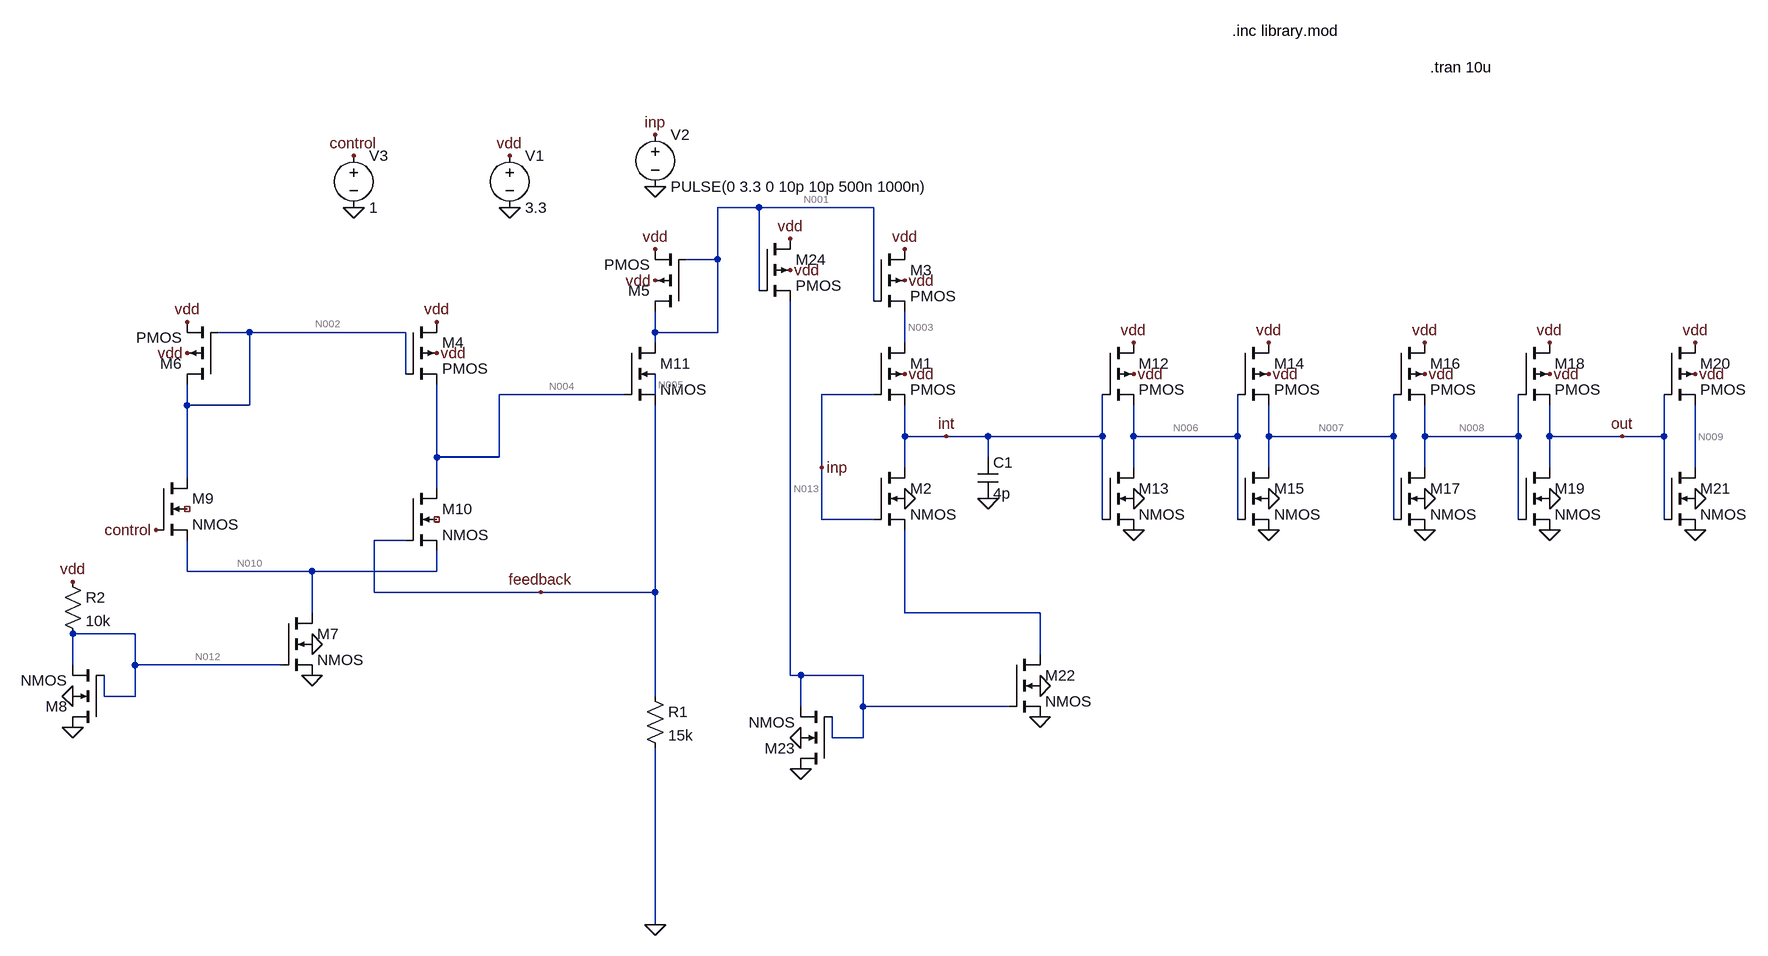
[diagram p0: schematic project2.asc]
project2.asc, the LTspice schematic file:
Version 4
SHEET 1 2180 1268
WIRE -864 144 -928 144
WIRE -688 144 -864 144
WIRE -928 224 -928 144
WIRE -928 224 -976 224
WIRE -864 272 -864 144
WIRE -688 288 -688 144
WIRE -1648 336 -1696 336
WIRE -1408 336 -1648 336
WIRE -1024 336 -1024 304
WIRE -928 336 -928 224
WIRE -928 336 -1024 336
WIRE -1024 352 -1024 336
WIRE -640 352 -640 304
WIRE -1408 400 -1408 336
WIRE -1072 432 -1264 432
WIRE -1024 432 -1024 400
WIRE -688 432 -768 432
WIRE -1744 448 -1744 416
WIRE -1648 448 -1648 336
WIRE -1648 448 -1744 448
WIRE -640 496 -640 448
WIRE -576 496 -640 496
WIRE -512 496 -576 496
WIRE -336 496 -336 432
WIRE -336 496 -512 496
WIRE -288 496 -288 448
WIRE -128 496 -128 432
WIRE -128 496 -288 496
WIRE -80 496 -80 448
WIRE 112 496 112 432
WIRE 112 496 -80 496
WIRE 160 496 160 448
WIRE 304 496 304 432
WIRE 304 496 160 496
WIRE 352 496 352 448
WIRE 464 496 352 496
WIRE 528 496 528 432
WIRE 528 496 464 496
WIRE -1360 528 -1360 416
WIRE -1264 528 -1264 432
WIRE -1264 528 -1360 528
WIRE -512 528 -512 496
WIRE -768 544 -768 432
WIRE -640 544 -640 496
WIRE -288 544 -288 496
WIRE -80 544 -80 496
WIRE 160 544 160 496
WIRE 352 544 352 496
WIRE 576 544 576 448
WIRE -1744 560 -1744 448
WIRE -1360 576 -1360 528
WIRE -768 624 -768 544
WIRE -688 624 -768 624
WIRE -336 624 -336 496
WIRE -128 624 -128 496
WIRE 112 624 112 496
WIRE 304 624 304 496
WIRE 528 624 528 496
WIRE -1408 656 -1456 656
WIRE -1744 704 -1744 656
WIRE -1552 704 -1744 704
WIRE -1360 704 -1360 672
WIRE -1360 704 -1552 704
WIRE -1456 736 -1456 656
WIRE -1200 736 -1456 736
WIRE -1024 736 -1024 448
WIRE -1024 736 -1200 736
WIRE -1552 768 -1552 704
WIRE -640 768 -640 640
WIRE -432 768 -640 768
WIRE -1824 800 -1920 800
WIRE -432 832 -432 768
WIRE -1920 848 -1920 800
WIRE -1824 848 -1824 800
WIRE -1600 848 -1824 848
WIRE -816 864 -816 288
WIRE -800 864 -816 864
WIRE -704 864 -800 864
WIRE -1872 896 -1872 864
WIRE -1824 896 -1824 848
WIRE -1824 896 -1872 896
WIRE -1024 896 -1024 736
WIRE -800 912 -800 864
WIRE -704 912 -704 864
WIRE -480 912 -704 912
WIRE -752 960 -752 928
WIRE -704 960 -704 912
WIRE -704 960 -752 960
WIRE -1024 1248 -1024 976
FLAG -1248 144 0
FLAG -1248 64 vdd
FLAG -1024 112 0
FLAG -1024 32 inp
FLAG -768 544 inp
FLAG -640 208 vdd
FLAG -1024 208 vdd
FLAG -1024 256 vdd
FLAG -640 256 vdd
FLAG -640 400 vdd
FLAG -640 592 0
FLAG -512 592 0
FLAG -1552 864 0
FLAG -1920 944 0
FLAG -1920 896 0
FLAG -1552 816 0
FLAG -1024 1248 0
FLAG -1920 720 vdd
FLAG -1360 320 vdd
FLAG -1744 320 vdd
FLAG -1744 368 vdd
FLAG -1360 368 vdd
FLAG -1488 64 control
FLAG -1488 144 0
FLAG -576 496 int
FLAG -288 400 vdd
FLAG -288 592 0
FLAG -288 640 0
FLAG -288 352 vdd
FLAG -80 400 vdd
FLAG -80 592 0
FLAG -80 640 0
FLAG -80 352 vdd
FLAG 160 400 vdd
FLAG 160 592 0
FLAG 160 640 0
FLAG 160 352 vdd
FLAG 352 400 vdd
FLAG 352 592 0
FLAG 352 640 0
FLAG 352 352 vdd
FLAG 576 400 vdd
FLAG 576 592 0
FLAG 576 640 0
FLAG 576 352 vdd
FLAG -1792 640 control
FLAG -432 928 0
FLAG -800 1008 0
FLAG -800 960 0
FLAG -432 880 0
FLAG -816 192 vdd
FLAG -816 240 vdd
FLAG 464 496 out
FLAG -1200 736 feedback
SYMBOL voltage -1248 48 R0
WINDOW 123 0 0 Left 0
WINDOW 39 0 0 Left 0
SYMATTR InstName V1
SYMATTR Value 3.3
SYMBOL voltage -1024 16 R0
WINDOW 123 0 0 Left 0
WINDOW 39 0 0 Left 0
SYMATTR InstName V2
SYMATTR Value PULSE(0 3.3 0 10p 10p 500n 1000n)
SYMBOL pmos4 -688 208 R0
SYMATTR InstName M3
SYMATTR Value2 l=0.6u w=0.4u
SYMBOL pmos4 -688 352 R0
SYMATTR InstName M1
SYMATTR Value2 l=0.35u w=0.4u
SYMBOL pmos4 -976 304 R180
SYMATTR InstName M5
SYMATTR Value2 l=0.6u w=1u
SYMBOL nmos4 -688 544 R0
SYMATTR InstName M2
SYMATTR Value2 l=0.35u w=0.4u
SYMBOL cap -528 528 R0
SYMATTR InstName C1
SYMATTR Value 4p
SYMBOL nmos4 -1600 768 R0
SYMATTR InstName M7
SYMATTR Value2 l=0.6u w=0.4u
SYMBOL nmos4 -1872 944 R180
SYMATTR InstName M8
SYMATTR Value2 l=0.6u w=0.4u
SYMBOL res -1936 704 R0
SYMATTR InstName R2
SYMATTR Value 10k
SYMBOL pmos4 -1408 320 R0
SYMATTR InstName M4
SYMATTR Value2 l=0.6u w=0.4u
SYMBOL pmos4 -1696 416 R180
SYMATTR InstName M6
SYMATTR Value2 l=0.6u w=0.4u
SYMBOL nmos4 -1792 560 R0
SYMATTR InstName M9
SYMATTR Value2 l=0.35u w=0.4u
SYMBOL nmos4 -1408 576 R0
SYMATTR InstName M10
SYMATTR Value2 l=0.35u w=0.4u
SYMBOL nmos4 -1072 352 R0
SYMATTR InstName M11
SYMATTR Value2 l=0.35u w=1u
SYMBOL voltage -1488 48 R0
WINDOW 123 0 0 Left 0
WINDOW 39 0 0 Left 0
SYMATTR InstName V3
SYMATTR Value 1
SYMBOL pmos4 -336 352 R0
SYMATTR InstName M12
SYMATTR Value2 l=0.35u w=0.4u
SYMBOL nmos4 -336 544 R0
SYMATTR InstName M13
SYMATTR Value2 l=0.35u w=0.4u
SYMBOL pmos4 -128 352 R0
SYMATTR InstName M14
SYMATTR Value2 l=0.35u w=0.4u
SYMBOL nmos4 -128 544 R0
SYMATTR InstName M15
SYMATTR Value2 l=0.35u w=0.4u
SYMBOL pmos4 112 352 R0
SYMATTR InstName M16
SYMATTR Value2 l=0.35u w=0.4u
SYMBOL nmos4 112 544 R0
SYMATTR InstName M17
SYMATTR Value2 l=0.35u w=0.4u
SYMBOL pmos4 304 352 R0
SYMATTR InstName M18
SYMATTR Value2 l=0.35u w=0.4u
SYMBOL nmos4 304 544 R0
SYMATTR InstName M19
SYMATTR Value2 l=0.35u w=0.4u
SYMBOL pmos4 528 352 R0
SYMATTR InstName M20
SYMATTR Value2 l=0.35u w=0.4u
SYMBOL nmos4 528 544 R0
SYMATTR InstName M21
SYMATTR Value2 l=0.35u w=0.4u
SYMBOL res -1040 880 R0
SYMATTR InstName R1
SYMATTR Value 15k
SYMBOL nmos4 -480 832 R0
SYMATTR InstName M22
SYMATTR Value2 l=0.6u w=0.4u
SYMBOL nmos4 -752 1008 R180
SYMATTR InstName M23
SYMATTR Value2 l=0.6u w=0.4u
SYMBOL pmos4 -864 192 R0
SYMATTR InstName M24
SYMATTR Value2 l=0.6u w=0.4u
TEXT -136 -128 Left 2 !.inc library.mod
TEXT 168 -72 Left 2 !.tran 10u

The netlist it stands for:
* project2.asc
V1 vdd 0 3.3
V2 inp 0 PULSE(0 3.3 0 10p 10p 500n 1000n)
M3 vdd N001 N003 vdd PMOS l=0.6u w=0.4u
M1 N003 inp int vdd PMOS l=0.35u w=0.4u
M5 N001 N001 vdd vdd PMOS l=0.6u w=1u
M2 int inp N011 0 NMOS l=0.35u w=0.4u
C1 int 0 4p
M7 N010 N012 0 0 NMOS l=0.6u w=0.4u
M8 0 N012 N012 0 NMOS l=0.6u w=0.4u
R2 vdd N012 10k
M4 vdd N002 N004 vdd PMOS l=0.6u w=0.4u
M6 N002 N002 vdd vdd PMOS l=0.6u w=0.4u
M9 N002 control N010 NC_01 NMOS l=0.35u w=0.4u
M10 N004 feedback N010 NC_02 NMOS l=0.35u w=0.4u
M11 N001 N004 feedback N005 NMOS l=0.35u w=1u
V3 control 0 1
M12 vdd int N006 vdd PMOS l=0.35u w=0.4u
M13 N006 int 0 0 NMOS l=0.35u w=0.4u
M14 vdd N006 N007 vdd PMOS l=0.35u w=0.4u
M15 N007 N006 0 0 NMOS l=0.35u w=0.4u
M16 vdd N007 N008 vdd PMOS l=0.35u w=0.4u
M17 N008 N007 0 0 NMOS l=0.35u w=0.4u
M18 vdd N008 out vdd PMOS l=0.35u w=0.4u
M19 out N008 0 0 NMOS l=0.35u w=0.4u
M20 vdd out N009 vdd PMOS l=0.35u w=0.4u
M21 N009 out 0 0 NMOS l=0.35u w=0.4u
R1 feedback 0 15k
M22 N011 N013 0 0 NMOS l=0.6u w=0.4u
M23 0 N013 N013 0 NMOS l=0.6u w=0.4u
M24 vdd N001 N013 vdd PMOS l=0.6u w=0.4u
.model NMOS NMOS
.model PMOS PMOS
.lib standard.mos
.inc library.mod
.tran 10u
.backanno
.end

* Results of the author's LTspice run, read from the files saved beside the schematic
* Operating Point, zero values left out:
*   V(vdd) = 3.3 V
*   V(n001) = 1.043 V
*   V(n003) = 3.3 V
*   V(int) = 3.3 V
*   V(n010) = 133.4 mV
*   V(n012) = 2.424 V
*   V(n002) = 1.46 V
*   V(n004) = 2.909 V
*   V(control) = 1 V
*   V(feedback) = 882 mV
*   V(n005) = 648.2 mV
*   V(n006) = 12.18 nV
*   V(n007) = 3.3 V
*   V(n008) = 12.18 nV
*   V(out) = 3.3 V
*   V(n009) = 12.18 nV
*   V(n013) = 1.268 V
*   Id(M23) = -18.89 µA
*   Ib(M23) = -1.278 pA
*   Is(M23) = 18.89 µA
*   Id(M21) = 3.31 pA
*   Is(M21) = -3.31 pA
*   Id(M19) = 3.421 pA
*   Ib(M19) = -3.31 pA
*   Id(M17) = 3.31 pA
*   Is(M17) = -3.31 pA
*   Id(M15) = 3.421 pA
*   Ib(M15) = -3.31 pA
*   Id(M13) = 3.31 pA
*   Is(M13) = -3.31 pA
*   Id(M11) = 58.8 µA
*   Is(M11) = -58.8 µA
*   Id(M10) = 6.605 µA
*   Is(M10) = -6.605 µA
*   Id(M9) = 10.44 µA
*   Is(M9) = -10.44 µA
*   Id(M8) = -87.59 µA
*   Ib(M8) = -2.434 pA
*   Is(M8) = 87.59 µA
*   Id(M7) = 17.05 µA
*   Is(M7) = -17.05 µA
*   Id(M2) = 3.421 pA
*   Ib(M2) = -3.31 pA
*   Id(M24) = 18.89 µA
*   Ib(M24) = 2.042 pA
*   Is(M24) = -18.89 µA
*   Ib(M20) = 3.31 pA
*   Is(M20) = -3.31 pA
*   Id(M18) = 3.421 pA
*   Is(M18) = -3.421 pA
*   Ib(M16) = 3.31 pA
*   Is(M16) = -3.31 pA
*   Id(M14) = 3.421 pA
*   Is(M14) = -3.421 pA
*   Ib(M12) = 3.31 pA
*   Is(M12) = -3.31 pA
*   Id(M6) = -10.44 µA
*   Ib(M6) = 1.85 pA
*   Is(M6) = 10.44 µA
*   Id(M4) = 6.605 µA
*   Is(M4) = -6.605 µA
*   Id(M5) = -58.8 µA
*   Ib(M5) = 2.267 pA
*   Is(M5) = 58.8 µA
*   Id(M1) = 3.421 pA
*   Is(M1) = -3.421 pA
*   Id(M3) = 3.421 pA
*   Is(M3) = -3.421 pA
*   I(R1) = 58.8 µA
*   I(R2) = 87.59 µA
*   I(V1) = -182.3 µA